# Altium project ADC_schematic.PrjPcb
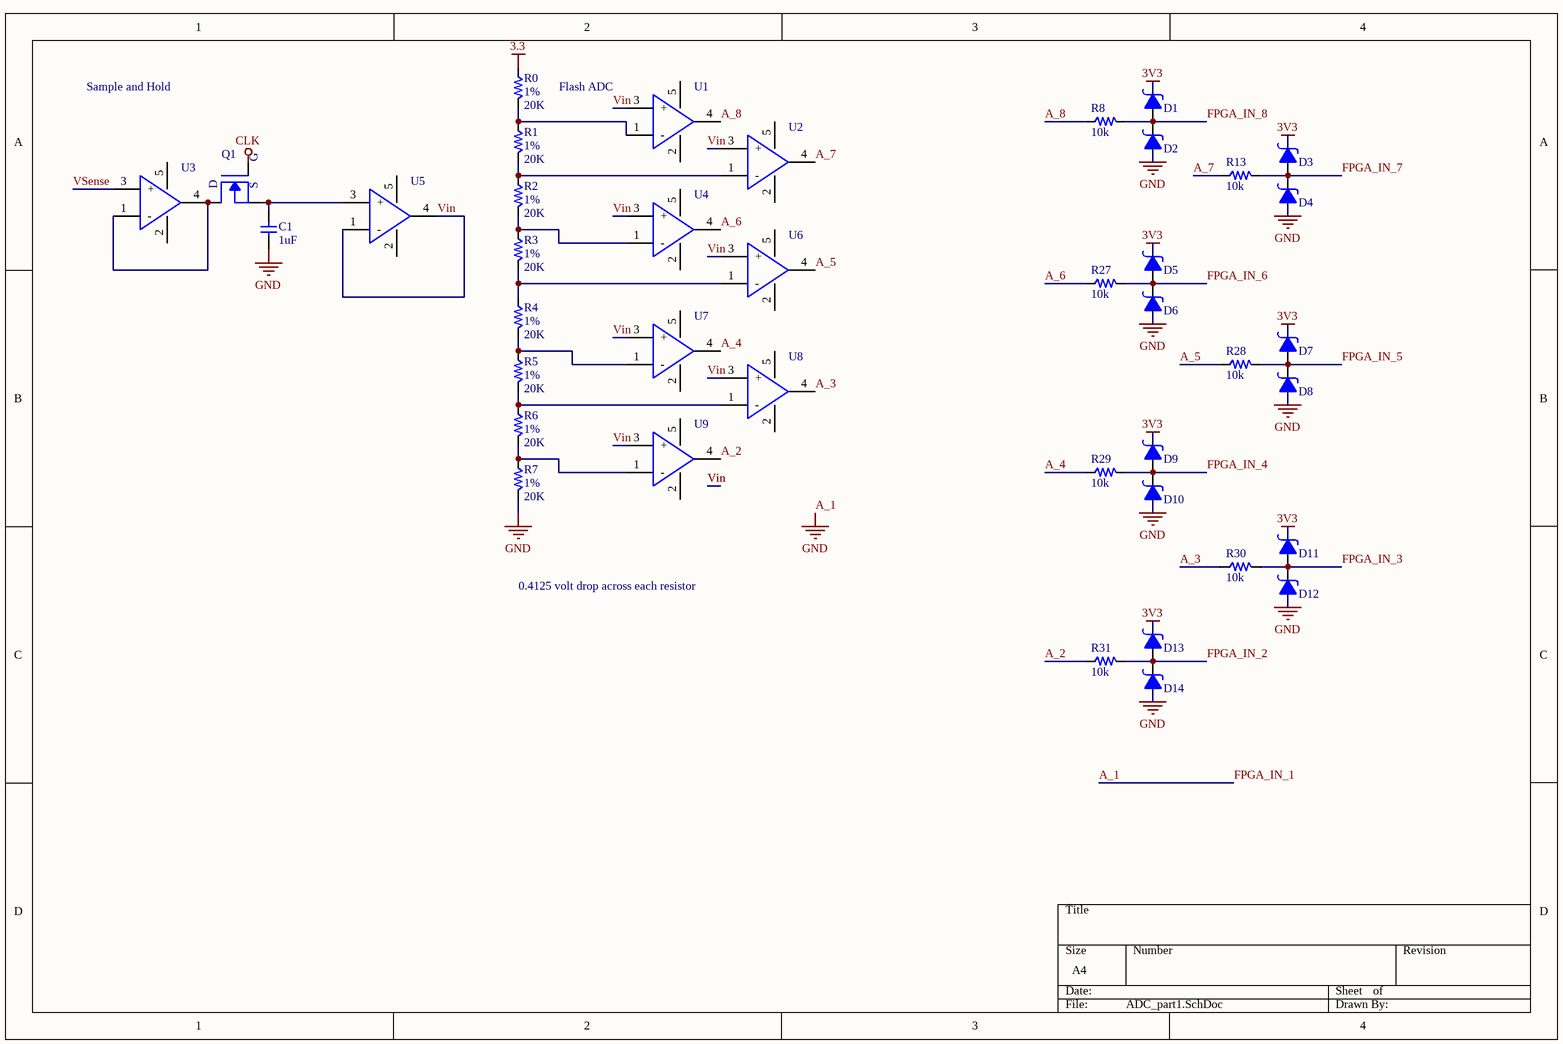
[diagram p0: ADC_part1.SchDoc]
3 sheets, 93 parts. Net scope: global (net labels, ports and power ports of the same name join across sheets).
Sheets:
  ADC_part1.SchDoc
  ADC_part2.SchDoc
  ADC_part3.SchDoc

## Sheet ADC_part1.SchDoc
size A4

### Parts
C1  value 1uF  [PCB_GENERIC_SMD_0603]  (hidden comment: C060-0001U-00)
D1  ONSEMI_MBRM110LT1G  [ON Semi Schottky Diode - MBRM110LT1G]  (value not drawn)
D2  ONSEMI_MBRM110LT1G  [ON Semi Schottky Diode - MBRM110LT1G]  (value not drawn)
D3  ONSEMI_MBRM110LT1G  [ON Semi Schottky Diode - MBRM110LT1G]  (value not drawn)
D4  ONSEMI_MBRM110LT1G  [ON Semi Schottky Diode - MBRM110LT1G]  (value not drawn)
D5  ONSEMI_MBRM110LT1G  [ON Semi Schottky Diode - MBRM110LT1G]  (value not drawn)
D6  ONSEMI_MBRM110LT1G  [ON Semi Schottky Diode - MBRM110LT1G]  (value not drawn)
D7  ONSEMI_MBRM110LT1G  [ON Semi Schottky Diode - MBRM110LT1G]  (value not drawn)
D8  ONSEMI_MBRM110LT1G  [ON Semi Schottky Diode - MBRM110LT1G]  (value not drawn)
D9  ONSEMI_MBRM110LT1G  [ON Semi Schottky Diode - MBRM110LT1G]  (value not drawn)
D10  ONSEMI_MBRM110LT1G  [ON Semi Schottky Diode - MBRM110LT1G]  (value not drawn)
D11  ONSEMI_MBRM110LT1G  [ON Semi Schottky Diode - MBRM110LT1G]  (value not drawn)
D12  ONSEMI_MBRM110LT1G  [ON Semi Schottky Diode - MBRM110LT1G]  (value not drawn)
D13  ONSEMI_MBRM110LT1G  [ON Semi Schottky Diode - MBRM110LT1G]  (value not drawn)
D14  ONSEMI_MBRM110LT1G  [ON Semi Schottky Diode - MBRM110LT1G]  (value not drawn)
Q1  NMOS - SSM3K333R  [NMOS - SSM3K333R - SOTFL95P180X88-3M]  (value not drawn)
R0  value 20K  Tolerance: 1%  [PCB_GENERIC_SMD_0603]  (hidden comment: R060-00103-01)
R1  value 20K  Tolerance: 1%  [PCB_GENERIC_SMD_0603]  (hidden comment: R060-00103-01)
R2  value 20K  Tolerance: 1%  [PCB_GENERIC_SMD_0603]  (hidden comment: R060-00103-01)
R3  value 20K  Tolerance: 1%  [PCB_GENERIC_SMD_0603]  (hidden comment: R060-00103-01)
R4  value 20K  Tolerance: 1%  [PCB_GENERIC_SMD_0603]  (hidden comment: R060-00103-01)
R5  value 20K  Tolerance: 1%  [PCB_GENERIC_SMD_0603]  (hidden comment: R060-00103-01)
R6  value 20K  Tolerance: 1%  [PCB_GENERIC_SMD_0603]  (hidden comment: R060-00103-01)
R7  value 20K  Tolerance: 1%  [PCB_GENERIC_SMD_0603]  (hidden comment: R060-00103-01)
R8  value 10k  [PCB_GENERIC_SMD_0603]  (hidden comment: R060-00101-05)
R13  value 10k  [PCB_GENERIC_SMD_0603]  (hidden comment: R060-00101-05)
R27  value 10k  [PCB_GENERIC_SMD_0603]  (hidden comment: R060-00101-05)
R28  value 10k  [PCB_GENERIC_SMD_0603]  (hidden comment: R060-00101-05)
R29  value 10k  [PCB_GENERIC_SMD_0603]  (hidden comment: R060-00101-05)
R30  value 10k  [PCB_GENERIC_SMD_0603]  (hidden comment: R060-00101-05)
R31  value 10k  [PCB_GENERIC_SMD_0603]  (hidden comment: R060-00101-05)
U1  AP331A  [SOT95P285X130-5N]  (value not drawn)
U2  AP331A  [SOT95P285X130-5N]  (value not drawn)
U3  AP331A  [SOT95P285X130-5N]  (value not drawn)
U4  AP331A  [SOT95P285X130-5N]  (value not drawn)
U5  AP331A  [SOT95P285X130-5N]  (value not drawn)
U6  AP331A  [SOT95P285X130-5N]  (value not drawn)
U7  AP331A  [SOT95P285X130-5N]  (value not drawn)
U8  AP331A  [SOT95P285X130-5N]  (value not drawn)
U9  AP331A  [SOT95P285X130-5N]  (value not drawn)

### Nets
3.3: R0.1
3V3: D1.1 D3.1 D5.1 D7.1 D9.1 D11.1 D13.1
A_1: C1.1 D2.2 D4.2 D6.2 D8.2 D10.2 D12.2 D14.2 R7.2  [also labelled FPGA_IN_1, GND]
CLK: Q1.1(G)
A_2: R31.1 U9.4(VOUT)
A_3: R30.1 U8.4(VOUT)
A_4: R29.1 U7.4(VOUT)
A_5: R28.1 U6.4(VOUT)
A_6: R27.1 U4.4(VOUT)
A_7: R13.1 U2.4(VOUT)
A_8: R8.1 U1.4(VOUT)
FPGA_IN_2: D13.2 D14.1 R31.2
FPGA_IN_3: D11.2 D12.1 R30.2
FPGA_IN_4: D9.2 D10.1 R29.2
FPGA_IN_5: D7.2 D8.1 R28.2
FPGA_IN_6: D5.2 D6.1 R27.2
FPGA_IN_7: D3.2 D4.1 R13.2
FPGA_IN_8: D1.2 D2.1 R8.2
Vin: U1.3(+) U2.3(+) U4.3(+) U5.1(-) U5.4(VOUT) U6.3(+) U7.3(+) U8.3(+) U9.3(+)
VSense: U3.3(+)
NetC1_2: C1.2 Q1.2(S) U5.3(+)
NetQ1_3: Q1.3(D) U3.1(-) U3.4(VOUT)
NetR0_2: R0.2 R1.1 U1.1(-)
NetR1_2: R1.2 R2.1 U2.1(-)
NetR2_2: R2.2 R3.1 U4.1(-)
NetR3_2: R3.2 R4.1 U6.1(-)
NetR4_2: R4.2 R5.1 U7.1(-)
NetR5_2: R5.2 R6.1 U8.1(-)
NetR6_2: R6.2 R7.1 U9.1(-)

Not connected (* = marked no-connect by the designer): U1 2(GND) 5(VCC); U2 2(GND) 5(VCC); U3 2(GND) 5(VCC); U4 2(GND) 5(VCC); U5 2(GND) 5(VCC); U6 2(GND) 5(VCC); U7 2(GND) 5(VCC); U8 2(GND) 5(VCC); U9 2(GND) 5(VCC)

### Notes on the sheet
- Sample and Hold
- Flash ADC
- 0.4125 volt drop across each resistor

### Library data of the parts
C1 = C060-0001U-00: CAP CER 0603 1uF 16V X5R 20%; Tolerance: 20%; Voltage: 16V; Package: 0603
D1-D14 = ONSEMI_MBRM110LT1G: DIODE SCHOTTKY 10V 1A; Supplier 1: Digi-Key; Supplier Part Number 1: MBRM110LT1GOSDKR-ND
Q1 = NMOS - SSM3K333R: MOSFET N CH 30V 6A 2-3Z1A; Supplier 1: Digi-Key; Supplier Part Number 1: SSM3K333RLFDKR-ND
R0-R7 = R060-00103-01: RES 0603 10K 1% 100mW; Power: 100mW; Package: 0603
R8 R13 R27-R31 = R060-00101-05: RES 0603 100ohm 5% 63mW; Tolerance: 5%; Power: 63mW; Package: 0603
U1-U9 = AP331A: Single Channel Comparator, Open Drain, SC-74A/SOT-753; Supplier 1: Digikey; Supplier Part Number 1: AP331AWGDICT-ND

## Sheet ADC_part2.SchDoc
size A4
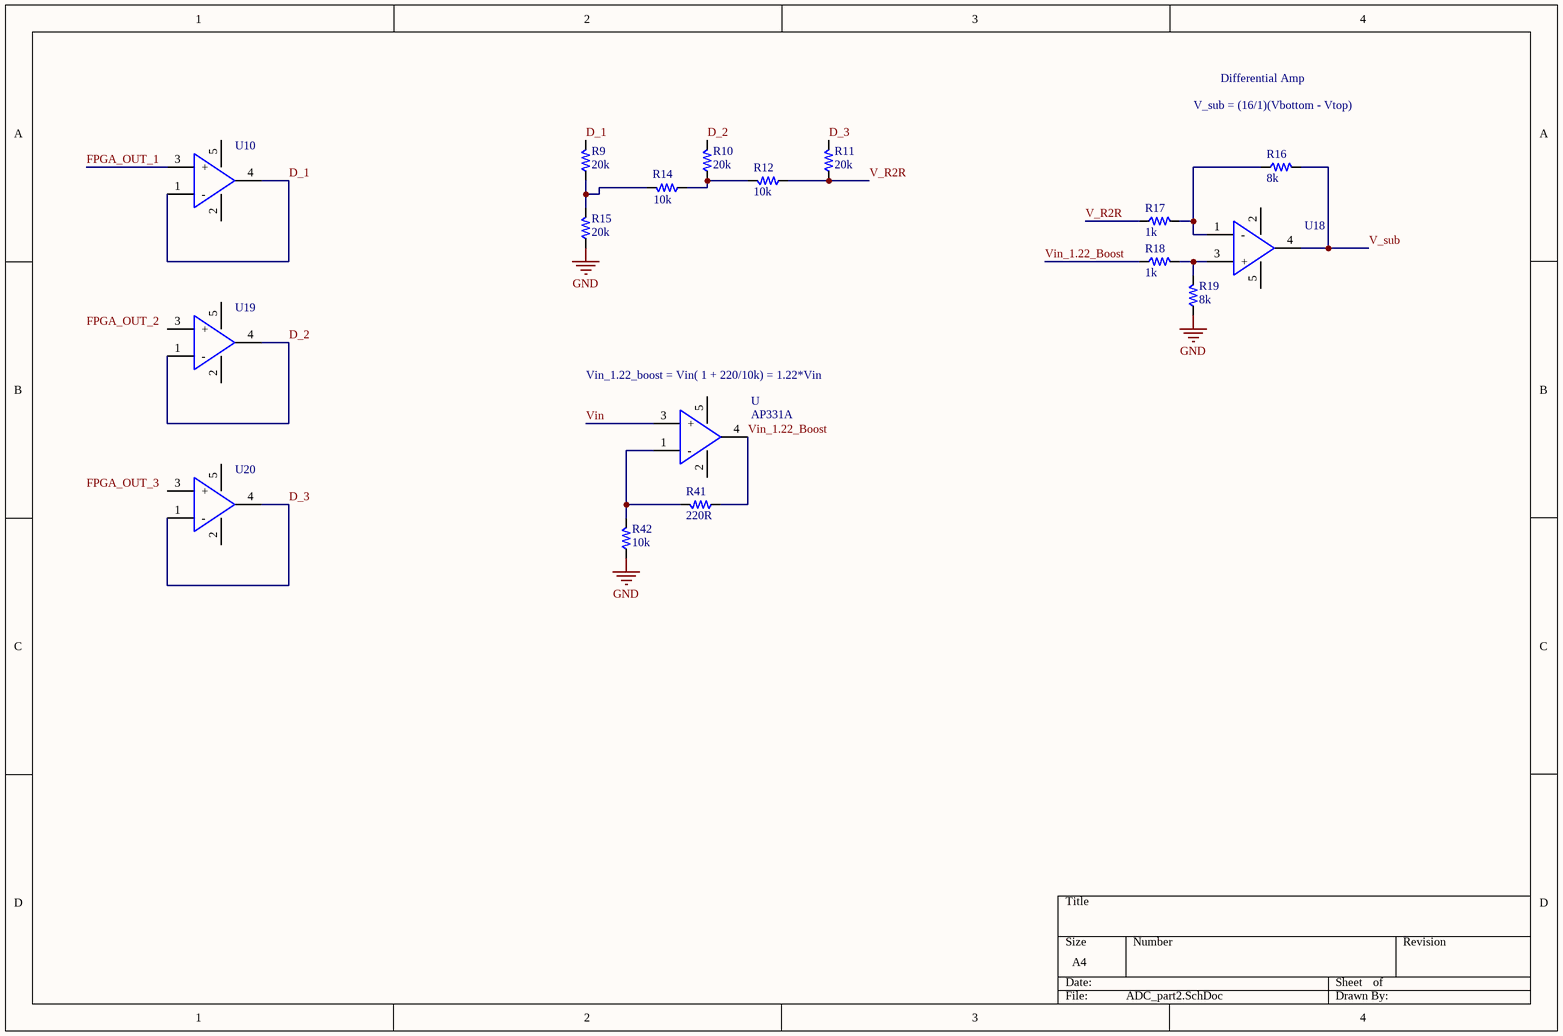
[diagram p1: ADC_part2.SchDoc]

### Parts
R9  value 20k  [PCB_GENERIC_SMD_0603]  (hidden comment: R060-00101-05)
R10  value 20k  [PCB_GENERIC_SMD_0603]  (hidden comment: R060-00101-05)
R11  value 20k  [PCB_GENERIC_SMD_0603]  (hidden comment: R060-00101-05)
R12  value 10k  [PCB_GENERIC_SMD_0603]  (hidden comment: R060-00101-05)
R14  value 10k  [PCB_GENERIC_SMD_0603]  (hidden comment: R060-00101-05)
R15  value 20k  [PCB_GENERIC_SMD_0603]  (hidden comment: R060-00101-05)
R16  value 8k  [PCB_GENERIC_SMD_0603]  (hidden comment: R060-00101-05)
R17  value 1k  [PCB_GENERIC_SMD_0603]  (hidden comment: R060-00101-05)
R18  value 1k  [PCB_GENERIC_SMD_0603]  (hidden comment: R060-00101-05)
R19  value 8k  [PCB_GENERIC_SMD_0603]  (hidden comment: R060-00101-05)
R41  value 220R  [PCB_GENERIC_SMD_0603]  (hidden comment: R060-00101-05)
R42  value 10k  [PCB_GENERIC_SMD_0603]  (hidden comment: R060-00101-05)
U  AP331A  [SOT95P285X130-5N]
U10  AP331A  [SOT95P285X130-5N]  (value not drawn)
U18  AP331A  [SOT95P285X130-5N]  (value not drawn)
U19  AP331A  [SOT95P285X130-5N]  (value not drawn)
U20  AP331A  [SOT95P285X130-5N]  (value not drawn)

### Nets
GND: R15.1 R19.1 R42.1  [project net A_1]
D_1: R9.2 U10.1(-) U10.4(VOUT)
D_2: R10.2 U19.1(-) U19.4(VOUT)
D_3: R11.2 U20.1(-) U20.4(VOUT)
FPGA_OUT_1: U10.3(+)
V_R2R: R11.1 R12.1 R17.1
V_sub: R16.2 U18.4(VOUT)
Vin: U.3(+)
Vin_1.22_Boost: R18.1 R41.1 U.4(VOUT)
NetR9_1: R9.1 R14.2 R15.2
NetR10_1: R10.1 R12.2 R14.1
NetR16_1: R16.1 R17.2 U18.1(-)
NetR18_2: R18.2 R19.2 U18.3(+)
NetR41_2: R41.2 R42.2 U.1(-)

Not connected (* = marked no-connect by the designer): U 2(GND) 5(VCC); U10 2(GND) 5(VCC); U18 2(GND) 5(VCC); U19 2(GND) 3(+) 5(VCC); U20 2(GND) 3(+) 5(VCC)

### Notes on the sheet
- V_sub = (16/1)(Vbottom - Vtop)
- Differential Amp
- (near U) Vin_1.22_boost = Vin( 1 + 220/10k) = 1.22*Vin
- Labels drawn without touching a wire or pin: FPGA_OUT_2, FPGA_OUT_3

### Library data of the parts
R9-R12 R14-R19 R41 R42 = R060-00101-05: RES 0603 100ohm 5% 63mW; Tolerance: 5%; Power: 63mW; Package: 0603
U U10 U18-U20 = AP331A: as U1 on sheet ADC_part1; Supplier 1: Digikey; Supplier Part Number 1: AP331AWGDICT-ND

## Sheet ADC_part3.SchDoc
size A4
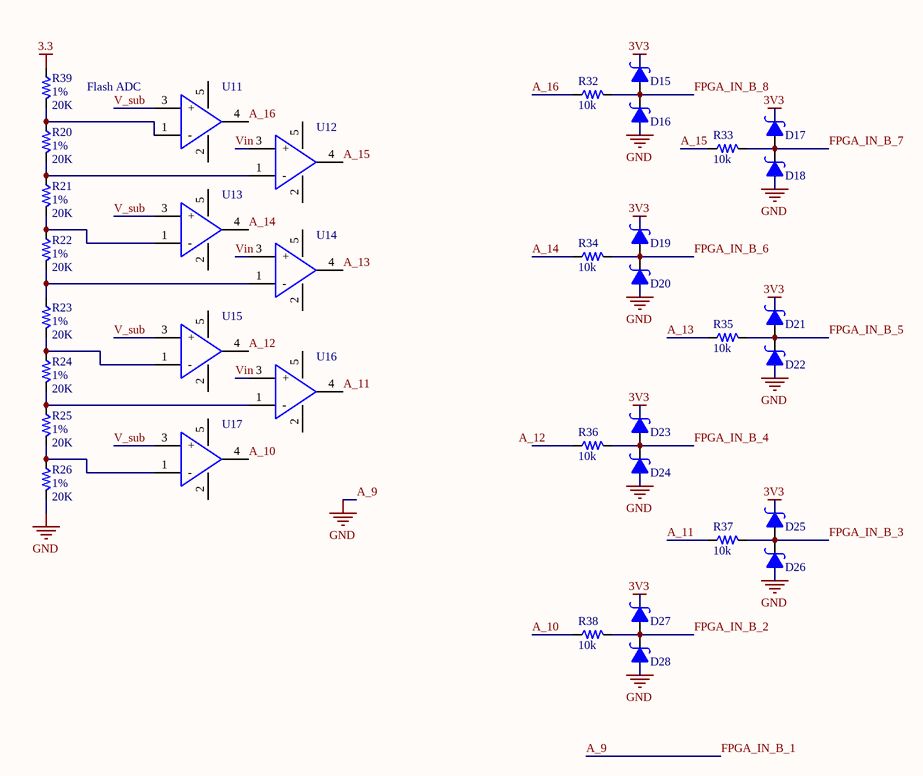
[diagram p2: ADC_part3.SchDoc]

### Parts
D15  ONSEMI_MBRM110LT1G  [ON Semi Schottky Diode - MBRM110LT1G]  (value not drawn)
D16  ONSEMI_MBRM110LT1G  [ON Semi Schottky Diode - MBRM110LT1G]  (value not drawn)
D17  ONSEMI_MBRM110LT1G  [ON Semi Schottky Diode - MBRM110LT1G]  (value not drawn)
D18  ONSEMI_MBRM110LT1G  [ON Semi Schottky Diode - MBRM110LT1G]  (value not drawn)
D19  ONSEMI_MBRM110LT1G  [ON Semi Schottky Diode - MBRM110LT1G]  (value not drawn)
D20  ONSEMI_MBRM110LT1G  [ON Semi Schottky Diode - MBRM110LT1G]  (value not drawn)
D21  ONSEMI_MBRM110LT1G  [ON Semi Schottky Diode - MBRM110LT1G]  (value not drawn)
D22  ONSEMI_MBRM110LT1G  [ON Semi Schottky Diode - MBRM110LT1G]  (value not drawn)
D23  ONSEMI_MBRM110LT1G  [ON Semi Schottky Diode - MBRM110LT1G]  (value not drawn)
D24  ONSEMI_MBRM110LT1G  [ON Semi Schottky Diode - MBRM110LT1G]  (value not drawn)
D25  ONSEMI_MBRM110LT1G  [ON Semi Schottky Diode - MBRM110LT1G]  (value not drawn)
D26  ONSEMI_MBRM110LT1G  [ON Semi Schottky Diode - MBRM110LT1G]  (value not drawn)
D27  ONSEMI_MBRM110LT1G  [ON Semi Schottky Diode - MBRM110LT1G]  (value not drawn)
D28  ONSEMI_MBRM110LT1G  [ON Semi Schottky Diode - MBRM110LT1G]  (value not drawn)
R20  value 20K  Tolerance: 1%  [PCB_GENERIC_SMD_0603]  (hidden comment: R060-00103-01)
R21  value 20K  Tolerance: 1%  [PCB_GENERIC_SMD_0603]  (hidden comment: R060-00103-01)
R22  value 20K  Tolerance: 1%  [PCB_GENERIC_SMD_0603]  (hidden comment: R060-00103-01)
R23  value 20K  Tolerance: 1%  [PCB_GENERIC_SMD_0603]  (hidden comment: R060-00103-01)
R24  value 20K  Tolerance: 1%  [PCB_GENERIC_SMD_0603]  (hidden comment: R060-00103-01)
R25  value 20K  Tolerance: 1%  [PCB_GENERIC_SMD_0603]  (hidden comment: R060-00103-01)
R26  value 20K  Tolerance: 1%  [PCB_GENERIC_SMD_0603]  (hidden comment: R060-00103-01)
R32  value 10k  [PCB_GENERIC_SMD_0603]  (hidden comment: R060-00101-05)
R33  value 10k  [PCB_GENERIC_SMD_0603]  (hidden comment: R060-00101-05)
R34  value 10k  [PCB_GENERIC_SMD_0603]  (hidden comment: R060-00101-05)
R35  value 10k  [PCB_GENERIC_SMD_0603]  (hidden comment: R060-00101-05)
R36  value 10k  [PCB_GENERIC_SMD_0603]  (hidden comment: R060-00101-05)
R37  value 10k  [PCB_GENERIC_SMD_0603]  (hidden comment: R060-00101-05)
R38  value 10k  [PCB_GENERIC_SMD_0603]  (hidden comment: R060-00101-05)
R39  value 20K  Tolerance: 1%  [PCB_GENERIC_SMD_0603]  (hidden comment: R060-00103-01)
U11  AP331A  [SOT95P285X130-5N]  (value not drawn)
U12  AP331A  [SOT95P285X130-5N]  (value not drawn)
U13  AP331A  [SOT95P285X130-5N]  (value not drawn)
U14  AP331A  [SOT95P285X130-5N]  (value not drawn)
U15  AP331A  [SOT95P285X130-5N]  (value not drawn)
U16  AP331A  [SOT95P285X130-5N]  (value not drawn)
U17  AP331A  [SOT95P285X130-5N]  (value not drawn)

### Nets
3.3: R39.1
3V3: D15.1 D17.1 D19.1 D21.1 D23.1 D25.1 D27.1
A_9: D16.2 D18.2 D20.2 D22.2 D24.2 D26.2 D28.2 R26.2  [also labelled FPGA_IN_B_1, GND]  [project net A_1]
A_10: R38.1 U17.4(VOUT)
A_11: R37.1 U16.4(VOUT)
A_12: U15.4(VOUT)
A_13: R35.1 U14.4(VOUT)
A_14: R34.1 U13.4(VOUT)
A_15: R33.1 U12.4(VOUT)
A_16: R32.1 U11.4(VOUT)
FPGA_IN_B_2: D27.2 D28.1 R38.2
FPGA_IN_B_3: D25.2 D26.1 R37.2
FPGA_IN_B_4: D23.2 D24.1 R36.2
FPGA_IN_B_5: D21.2 D22.1 R35.2
FPGA_IN_B_6: D19.2 D20.1 R34.2
FPGA_IN_B_7: D17.2 D18.1 R33.2
FPGA_IN_B_8: D15.2 D16.1 R32.2
V_sub: U11.3(+) U13.3(+) U15.3(+) U17.3(+)
Vin: U12.3(+) U14.3(+) U16.3(+)
NetR20_1: R20.1 R39.2 U11.1(-)
NetR20_2: R20.2 R21.1 U12.1(-)
NetR21_2: R21.2 R22.1 U13.1(-)
NetR22_2: R22.2 R23.1 U14.1(-)
NetR23_2: R23.2 R24.1 U15.1(-)
NetR24_2: R24.2 R25.1 U16.1(-)
NetR25_2: R25.2 R26.1 U17.1(-)

Not connected (* = marked no-connect by the designer): R36 1; U11 2(GND) 5(VCC); U12 2(GND) 5(VCC); U13 2(GND) 5(VCC); U14 2(GND) 5(VCC); U15 2(GND) 5(VCC); U16 2(GND) 5(VCC); U17 2(GND) 5(VCC)

### Notes on the sheet
- Flash ADC
- Labels drawn without touching a wire or pin: A_12

### Library data of the parts
D15-D28 = ONSEMI_MBRM110LT1G: DIODE SCHOTTKY 10V 1A; Supplier 1: Digi-Key; Supplier Part Number 1: MBRM110LT1GOSDKR-ND
R20-R26 R39 = R060-00103-01: RES 0603 10K 1% 100mW; Power: 100mW; Package: 0603
R32-R38 = R060-00101-05: RES 0603 100ohm 5% 63mW; Tolerance: 5%; Power: 63mW; Package: 0603
U11-U17 = AP331A: as U1 on sheet ADC_part1; Supplier 1: Digikey; Supplier Part Number 1: AP331AWGDICT-ND

## Nets that join several sheets
3.3: ADC_part1 (R0.1), ADC_part3 (R39.1)
3V3: ADC_part1 (7 pins), ADC_part3 (7 pins)
A_1: ADC_part1 (9 pins), ADC_part2 (R15.1 R19.1 R42.1), ADC_part3 (8 pins)
V_sub: ADC_part2 (R16.2 U18.4), ADC_part3 (U11.3 U13.3 U15.3 U17.3)
Vin: ADC_part1 (9 pins), ADC_part2 (U.3), ADC_part3 (U12.3 U14.3 U16.3)